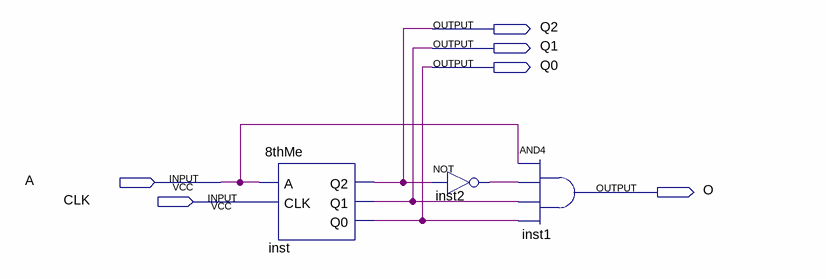
[diagram p0: schematic sheet]
// Quartus schematic Mealy.bdf as structural Verilog: 3 symbols, 6 pins
module Mealy (
  input  A,
  input  CLK,
  output Q2,
  output Q1,
  output Q0,
  output O
);

  wire inst2_out;

  \8thMe  inst (.A(A), .CLK(CLK), .Q2(Q2), .Q1(Q1), .Q0(Q0));
  not inst2 (inst2_out, Q2);
  and inst1 (O, A, inst2_out, Q1, Q0);
endmodule
